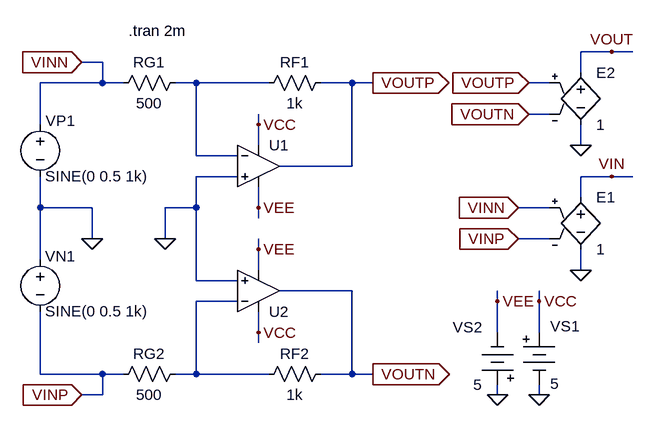
[diagram p0: schematic fig-02-05-15.asc]
fig-02-05-15.asc, the LTspice schematic file:
Version 4
SHEET 1 1332 680
WIRE 800 -288 752 -288
WIRE 832 -288 800 -288
WIRE 16 -272 -16 -272
WIRE 752 -256 752 -288
WIRE 16 -240 16 -272
WIRE 16 -240 -80 -240
WIRE 48 -240 16 -240
WIRE 160 -240 128 -240
WIRE 272 -240 160 -240
WIRE 400 -240 352 -240
WIRE 432 -240 400 -240
WIRE 704 -240 672 -240
WIRE 704 -192 672 -192
WIRE -80 -176 -80 -240
WIRE 256 -176 256 -192
WIRE 256 -144 256 -176
WIRE 752 -144 752 -176
WIRE 160 -128 160 -240
WIRE 224 -128 160 -128
WIRE 400 -112 400 -240
WIRE 400 -112 288 -112
WIRE 224 -96 160 -96
WIRE 800 -96 752 -96
WIRE 832 -96 800 -96
WIRE 752 -64 752 -96
WIRE -80 -48 -80 -96
WIRE 0 -48 -80 -48
WIRE 160 -48 160 -96
WIRE 160 -48 112 -48
WIRE 256 -48 256 -80
WIRE 704 -48 656 -48
WIRE 256 -32 256 -48
WIRE 0 0 0 -48
WIRE 112 0 112 -48
WIRE 704 0 656 0
WIRE 256 16 256 0
WIRE -80 32 -80 -48
WIRE 256 48 256 16
WIRE 752 48 752 16
WIRE 160 64 160 -48
WIRE 224 64 160 64
WIRE 400 80 288 80
WIRE 224 96 160 96
WIRE 624 96 624 80
WIRE 688 96 688 80
WIRE 256 144 256 112
WIRE 624 144 624 96
WIRE 688 144 688 96
WIRE 256 160 256 144
WIRE -80 208 -80 112
WIRE 16 208 -80 208
WIRE 48 208 16 208
WIRE 160 208 160 96
WIRE 160 208 128 208
WIRE 272 208 160 208
WIRE 400 208 400 80
WIRE 400 208 352 208
WIRE 432 208 400 208
WIRE 16 240 16 208
WIRE 16 240 -16 240
WIRE 624 240 624 224
WIRE 688 240 688 224
FLAG 432 -240 VOUTP
IOPIN 432 -240 Out
FLAG 624 240 0
FLAG 688 240 0
FLAG 624 96 VEE
FLAG 688 96 VCC
FLAG 256 -176 VCC
FLAG 256 16 VEE
FLAG 432 208 VOUTN
IOPIN 432 208 Out
FLAG -16 -272 VINN
IOPIN -16 -272 In
FLAG -16 240 VINP
IOPIN -16 240 In
FLAG 752 -144 0
FLAG 752 48 0
FLAG 656 0 VINP
IOPIN 656 0 In
FLAG 656 -48 VINN
IOPIN 656 -48 In
FLAG 672 -192 VOUTN
IOPIN 672 -192 In
FLAG 672 -240 VOUTP
IOPIN 672 -240 In
FLAG 800 -96 VIN
FLAG 800 -288 VOUT
FLAG 256 -48 VEE
FLAG 256 144 VCC
FLAG 112 0 0
FLAG 0 0 0
SYMBOL res 368 -256 R90
WINDOW 0 0 56 VBottom 2
WINDOW 3 32 56 VTop 2
SYMATTR InstName RF1
SYMATTR Value 1k
SYMBOL res 144 -256 R90
WINDOW 0 0 56 VBottom 2
WINDOW 3 32 56 VTop 2
SYMATTR InstName RG1
SYMATTR Value 500
SYMBOL voltage -80 -192 R0
WINDOW 0 31 26 Bottom 2
WINDOW 3 87 111 Bottom 2
WINDOW 123 35 89 Top 2
WINDOW 39 0 0 Left 0
SYMATTR InstName VP1
SYMATTR Value SINE(0 0.5 1k)
SYMBOL Misc\\battery 688 128 R0
WINDOW 0 17 6 Left 2
WINDOW 3 17 95 Left 2
WINDOW 123 0 0 Left 0
WINDOW 39 0 0 Left 0
SYMATTR InstName VS1
SYMATTR Value 5
SYMBOL Misc\\battery 624 240 R180
WINDOW 0 24 104 Left 2
WINDOW 3 24 16 Left 2
WINDOW 123 0 0 Left 0
WINDOW 39 0 0 Left 0
SYMATTR InstName VS2
SYMATTR Value 5
SYMBOL res 368 192 R90
WINDOW 0 0 56 VBottom 2
WINDOW 3 32 56 VTop 2
SYMATTR InstName RF2
SYMATTR Value 1k
SYMBOL res 144 192 R90
WINDOW 0 0 56 VBottom 2
WINDOW 3 32 56 VTop 2
SYMATTR InstName RG2
SYMATTR Value 500
SYMBOL e 752 -80 R0
SYMATTR InstName E1
SYMATTR Value 1
SYMBOL e 752 -272 R0
SYMATTR InstName E2
SYMATTR Value 1
SYMBOL Opamps\\UniversalOpamp2 256 -112 R0
SYMATTR InstName U1
SYMBOL Opamps\\UniversalOpamp2 256 80 M180
SYMATTR InstName U2
SYMBOL voltage -80 16 R0
WINDOW 0 31 26 Bottom 2
WINDOW 3 87 111 Bottom 2
WINDOW 123 35 89 Top 2
WINDOW 39 0 0 Left 0
SYMATTR InstName VN1
SYMATTR Value SINE(0 0.5 1k)
TEXT 56 -320 Left 2 !.tran 2m

The netlist it stands for:
* fig-02-05-15.asc
RF1 VOUTP N001 1k
RG1 N001 VINN 500
VP1 VINN 0 SINE(0 0.5 1k)
VS1 VCC 0 5
VS2 0 VEE 5
RF2 VOUTN N002 1k
RG2 N002 VINP 500
E1 VIN 0 VINN VINP 1
E2 VOUT 0 VOUTP VOUTN 1
XU1 0 N001 VCC VEE VOUTP level.2 Avol=1Meg GBW=10Meg Slew=10Meg ilimit=25m rail=0 Vos=0 phimargin=45 en=0 enk=0 in=0 ink=0 Rin=500Meg  ; pins IN+ IN- V+ V- OUT
XU2 0 N002 VCC VEE VOUTN level.2 Avol=1Meg GBW=10Meg Slew=10Meg ilimit=25m rail=0 Vos=0 phimargin=45 en=0 enk=0 in=0 ink=0 Rin=500Meg  ; pins IN+ IN- V+ V- OUT
VN1 0 VINP SINE(0 0.5 1k)
.tran 2m
.lib UniversalOpamps2.sub
.backanno
.end